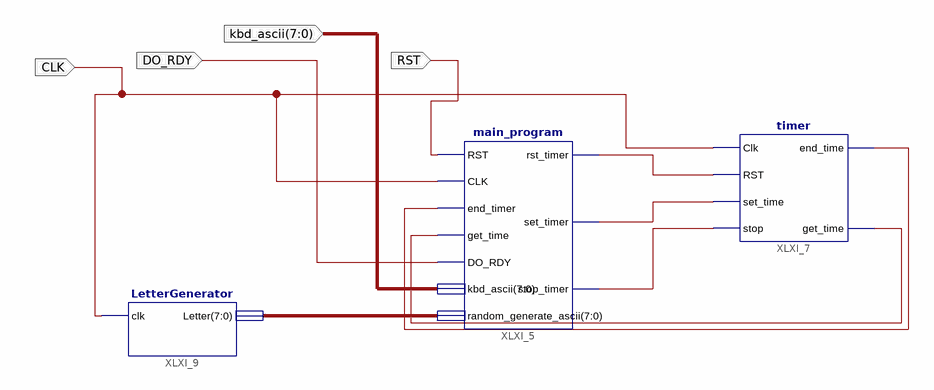
[diagram p0: schematic sheet 1]
// Xilinx ISE schematic MainScheme.sch (aspartan6) as structural Verilog: 3 symbols, 4 ports
module MainScheme (
  input  CLK,
  input  RST,
  input  DO_RDY,
  input  [7:0] kbd_ascii
);

  wire XLXN_2, XLXN_3, XLXN_4, XLXN_5, XLXN_6;
  wire [7:0] XLXN_24;

  main_program XLXI_5 (
    .RST(RST), .CLK(CLK), .end_timer(XLXN_5), .get_time(XLXN_6), .DO_RDY(DO_RDY), .kbd_ascii(kbd_ascii),
    .rst_timer(XLXN_2), .set_timer(XLXN_3), .stop_timer(XLXN_4), .random_generate_ascii(XLXN_24));
  timer XLXI_7 (.Clk(CLK), .RST(XLXN_2), .set_time(XLXN_3), .stop(XLXN_4), .end_time(XLXN_5), .get_time(XLXN_6));
  LetterGenerator XLXI_9 (.clk(CLK), .Letter(XLXN_24));
endmodule
